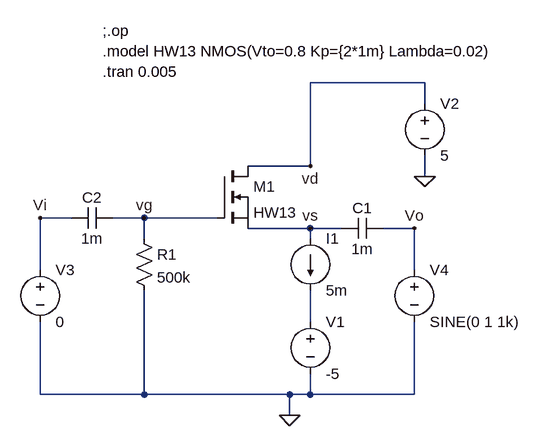
[diagram p0: schematic ECE3300_Hw13.asc]
ECE3300_Hw13.asc, the LTspice schematic file:
Version 4
SHEET 1 908 680
WIRE 448 -112 272 -112
WIRE 448 -80 448 -112
WIRE 272 16 272 -112
WIRE 272 16 176 16
WIRE 448 32 448 0
WIRE -96 96 -144 96
WIRE 16 96 -32 96
WIRE 128 96 16 96
WIRE 272 112 176 112
WIRE 320 112 272 112
WIRE 432 112 384 112
WIRE 16 128 16 96
WIRE 272 128 272 112
WIRE -144 176 -144 96
WIRE 432 176 432 112
WIRE 272 256 272 208
WIRE -144 368 -144 256
WIRE 16 368 16 208
WIRE 16 368 -144 368
WIRE 240 368 16 368
WIRE 272 368 272 336
WIRE 272 368 240 368
WIRE 432 368 432 256
WIRE 432 368 272 368
WIRE 240 400 240 368
FLAG 240 400 0
FLAG 272 16 vd
FLAG 272 112 vs
FLAG 16 96 vg
FLAG 448 32 0
FLAG -144 96 Vi
FLAG 432 112 Vo
SYMBOL res 0 112 R0
SYMATTR InstName R1
SYMATTR Value 500k
SYMBOL current 272 128 R0
WINDOW 123 0 0 Left 0
WINDOW 39 0 0 Left 0
SYMATTR InstName I1
SYMATTR Value 5m
SYMBOL nmos 128 16 R0
SYMATTR InstName M1
SYMATTR Value HW13
SYMBOL voltage 272 240 R0
WINDOW 123 0 0 Left 0
WINDOW 39 0 0 Left 0
SYMATTR InstName V1
SYMATTR Value -5
SYMBOL voltage 448 -96 R0
WINDOW 123 0 0 Left 0
WINDOW 39 0 0 Left 0
SYMATTR InstName V2
SYMATTR Value 5
SYMBOL voltage -144 160 R0
WINDOW 123 0 0 Left 0
WINDOW 39 0 0 Left 0
SYMATTR InstName V3
SYMATTR Value 0
SYMBOL cap 384 96 R90
WINDOW 0 0 32 VBottom 2
WINDOW 3 32 32 VTop 2
SYMATTR InstName C1
SYMATTR Value 1m
SYMBOL cap -32 80 R90
WINDOW 0 0 32 VBottom 2
WINDOW 3 32 32 VTop 2
SYMATTR InstName C2
SYMATTR Value 1m
SYMBOL voltage 432 160 R0
WINDOW 123 0 0 Left 0
WINDOW 39 0 0 Left 0
SYMATTR InstName V4
SYMATTR Value SINE(0 1 1k)
TEXT -48 -192 Left 2 !;.op\n.model HW13 NMOS(Vto=0.8 Kp={2*1m} Lambda=0.02)\n.tran 0.005

The netlist it stands for:
* ECE3300_Hw13.asc
R1 vg 0 500k
I1 vs N001 5m
M1 vd vg vs vs HW13
V1 N001 0 -5
V2 vd 0 5
V3 Vi 0 0
C1 Vo vs 1m
C2 vg Vi 1m
V4 Vo 0 SINE(0 1 1k)
.model NMOS NMOS
.model PMOS PMOS
.lib standard.mos
;.op
.model HW13 NMOS(Vto=0.8 Kp={2*1m} Lambda=0.02)
.tran 0.005
.backanno
.end